# Altium schematic sheet Schematic.SchDoc: Vibration Damping System for surgical robots
size A4; SheetNumber: 1; SheetTotal: 2
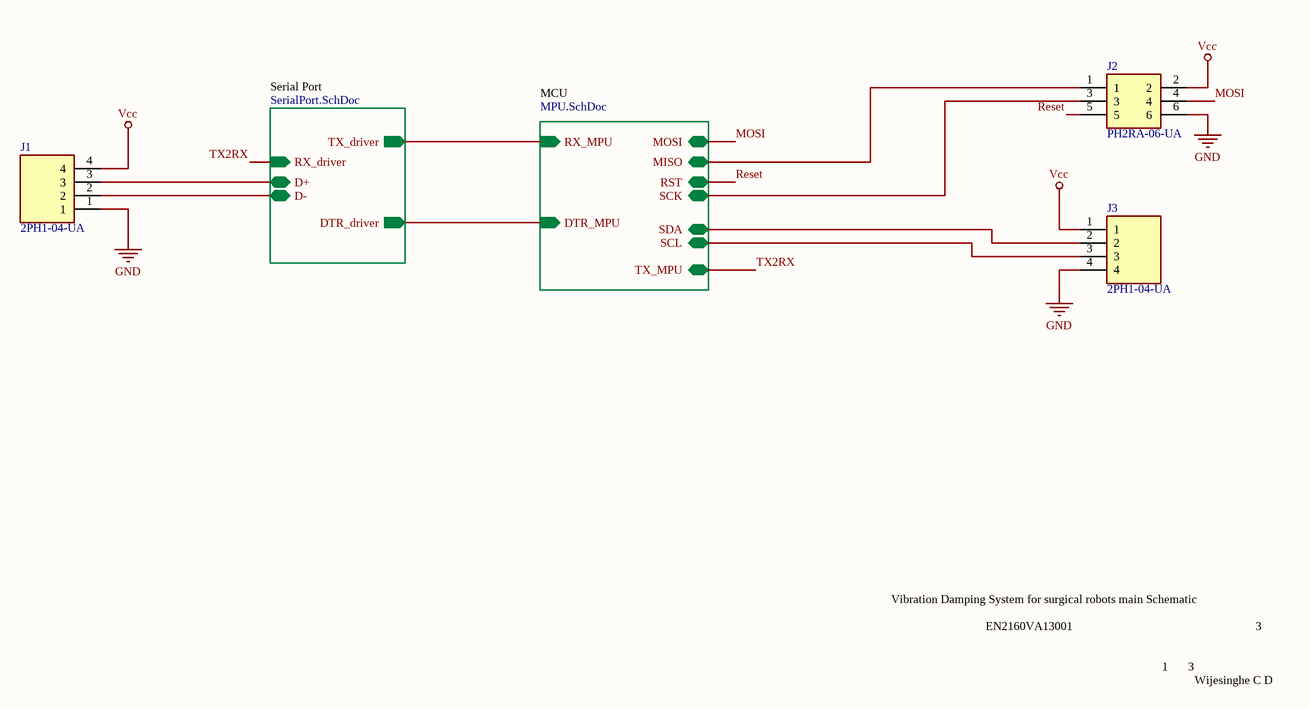
[diagram p0: Schematic.SchDoc]

## Parts
J1  2PH1-04-UA  [HDRV4W50P0X200_1X4_800X200X590P]
J2  PH2RA-06-UA  [HDRRA6W64P254_2X3_762X250X500P]
J3  2PH1-04-UA  [HDRV4W50P0X200_1X4_800X200X590P]

## Sub-sheets
MCU = MPU.SchDoc: SCK (bidir), SCL (bidir), TX_MPU (bidir), RX_MPU (in), DTR_MPU (in), MISO (bidir), MOSI (bidir), RST (bidir), SDA (bidir)
Serial Port = SerialPort.SchDoc: RX_driver (in), TX_driver (out), DTR_driver (out), D+ (bidir), D- (bidir)

## Nets
GND: J1.1 J2.6 J3.4
Vcc: J1.4 J2.2 J3.1
MOSI: J2.4 ; sheet MCU/MOSI
Reset: J2.5 ; sheet MCU/RST
TX2RX: sheet MCU/TX_MPU, sheet Serial Port/RX_driver
NetJ1_2: J1.2 ; sheet Serial Port/D-
NetJ1_3: J1.3 ; sheet Serial Port/D+
NetJ2_1: J2.1 ; sheet MCU/MISO
NetJ2_3: J2.3 ; sheet MCU/SCK
NetJ3_2: J3.2 ; sheet MCU/SDA
NetJ3_3: J3.3 ; sheet MCU/SCL
(unnamed): sheet MCU/RX_MPU, sheet Serial Port/TX_driver
(unnamed): sheet MCU/DTR_MPU, sheet Serial Port/DTR_driver

## Notes on the sheet
- Vibration Damping System for surgical robots main Schematic <https://github.com/Vibration-Analysis/Vibration-Analysing-system-for-Robot-arms>
- EN2160VA13001
- 1
- 3
- Wijesinghe C D
- Title:
- Author:
- Approved:
- Size:
- Date:
- Git Hash:
- A4
- Prj:
- SW Version:
- Variant:
- Edited:
- CONFIDENTIAL
- File:

## Library data of the parts
J1 J3 = 2PH1-04-UA: Connector; Manufacturer_Name: Adam Tech; Datasheet Link: https://datasheet.datasheetarchive.com/originals/distributors/Datasheets_SAMA/1340c19c3c34daa1512378d1cc9f6be0.pdf; Height: 5.9mm; Manufacturer_Part_Number: 2PH1-04-UA; Mouser Part Number: 737-2PH1-04-UA; Mouser Price/Stock: https://www.mouser.co.uk/ProductDetail/Adam-Tech/2PH1-04-UA?qs=HoCaDK9Nz5foLmmthkPmJw%3D%3D
J2 = PH2RA-06-UA: Connector; Manufacturer_Name: Adam Tech; Datasheet Link: https://static6.arrow.com/aropdfconversion/38d430c3bbd26836f869f57df34a7f03090e7de1/782downloader.phppph2ra-xx-ua.pdf; Height: 5mm; Manufacturer_Part_Number: PH2RA-06-UA; Arrow Part Number: PH2RA-06-UA; Arrow Price/Stock: https://www.arrow.com/en/products/ph2ra-06-ua/adam-tech